# Altium schematic sheet On Board Terminals.SchDoc
size 297 x 209 mm; SheetNumber: 4; SheetTotal: 4
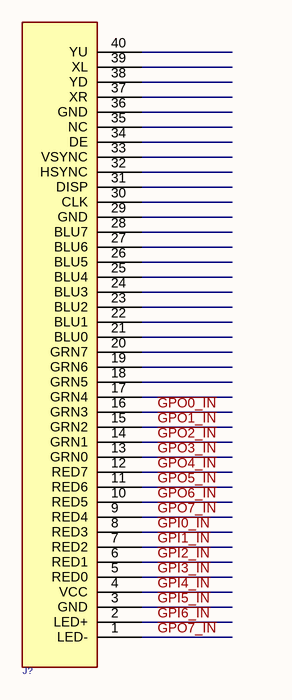
[diagram p0: On Board Terminals.SchDoc]

## Parts
J?  FPC50 40  [FPC50_40]  (value not drawn)

## Nets
~{GPI0_IN}: J?.8(RED3)
~{GPI1_IN}: J?.7(RED2)
~{GPI2_IN}: J?.6(RED1)
~{GPI3_IN}: J?.5(RED0)
~{GPI4_IN}: J?.4(VCC)
~{GPI5_IN}: J?.3(GND)
~{GPI6_IN}: J?.2(LED+)
~{GPO0_IN}: J?.16(GRN3)
~{GPO1_IN}: J?.15(GRN2)
~{GPO2_IN}: J?.14(GRN1)
~{GPO3_IN}: J?.13(GRN0)
~{GPO4_IN}: J?.12(RED7)
~{GPO5_IN}: J?.11(RED6)
~{GPO6_IN}: J?.10(RED5)
~{GPO7_IN}: J?.1(LED-) J?.9(RED4)

Not connected (* = marked no-connect by the designer): J? 17(GRN4) 18(GRN5) 19(GRN6) 20(GRN7) 21(BLU0) 22(BLU1) 23(BLU2) 24(BLU3) 25(BLU4) 26(BLU5) 27(BLU6) 28(BLU7) 29(GND) 30(CLK) 31(DISP) 32(HSYNC) 33(VSYNC) 34(DE) 35(NC) 36(GND) 37(XR) 38(YD) 39(XL) 40(YU)

## Notes on the sheet
- Drawn
- Name
- Date
- Drawing Title
- Checked
- Drawing No.
- Approved
- Size
- A4
- Ver.
- Rev.
- Sheet
- Of

## Library data of the parts
J? = FPC50 40: CONN, FPC, 0.50mm pitch, RightAngle, Bot. Contact; ComponentLink1Description: Website Smart World; ComponentLink1URL: https://www.smartw.ir/; ComponentLink2Description: Telegram; ComponentLink2URL: https://t.me/altium_smartw; ComponentLink3Description: Instagram; ComponentLink3URL: https://Instagram.com/smartgw.ir; DatasheetVersion: 2021